# EAGLE design circuit_for_fab (EAGLE 5.11)
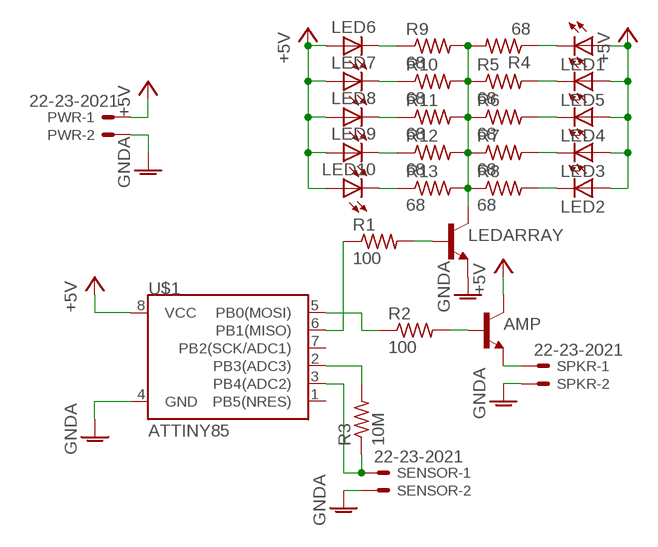
[diagram p0: schematic, sheet 1]

## Parts
AMP  -NPN-TO92-EBC  [TO92-EBC]
LED1  LED5MM  [LED5MM]
LED2  LED5MM  [LED5MM]
LED3  LED5MM  [LED5MM]
LED4  LED5MM  [LED5MM]
LED5  LED5MM  [LED5MM]
LED6  LED5MM  [LED5MM]
LED7  LED5MM  [LED5MM]
LED8  LED5MM  [LED5MM]
LED9  LED5MM  [LED5MM]
LED10  LED5MM  [LED5MM]
LEDARRAY  -NPN-TO92-EBC  [TO92-EBC]
PWR  22-23-2021  [22-23-2021]
R1  100  R-US_0204/7  [0204/7]
R2  100  R-US_0204/7  [0204/7]
R3  10M  R-US_0204/7  [0204/7]
R4  68  R-US_0204/7  [0204/7]
R5  68  R-US_0204/7  [0204/7]
R6  68  R-US_0204/7  [0204/7]
R7  68  R-US_0204/7  [0204/7]
R8  68  R-US_0204/7  [0204/7]
R9  68  R-US_0204/7  [0204/7]
R10  68  R-US_0204/7  [0204/7]
R11  68  R-US_0204/7  [0204/7]
R12  68  R-US_0204/7  [0204/7]
R13  68  R-US_0204/7  [0204/7]
SENSOR  22-23-2021  [22-23-2021]
SPKR  22-23-2021  [22-23-2021]
U$1  ATTINY85  ATTINY45DIP8  [DIP08]

## Nets
+5V: AMP.C LED1.A LED2.A LED3.A LED4.A LED5.A LED6.A LED7.A LED8.A LED9.A LED10.A PWR.1 U$1.8(VCC)
GNDA: LEDARRAY.E PWR.2 SENSOR.2 SPKR.2 U$1.4(GND)
N$1: R3.2 U$1.2(PB3(ADC3))
N$2: LED1.K(C) R4.1
N$3: R1.1 U$1.6(PB1(MISO))
N$4: AMP.B R2.2
N$5: LEDARRAY.C R4.2 R5.1 R6.1 R7.1 R8.1 R9.2 R10.2 R11.2 R12.2 R13.2
N$6: LEDARRAY.B R1.2
N$7: R2.1 U$1.5(PB0(MOSI))
N$8: AMP.E SPKR.1
N$10: LED5.K(C) R5.2
N$11: LED4.K(C) R6.2
N$12: LED3.K(C) R7.2
N$13: LED2.K(C) R8.2
N$14: LED6.K(C) R9.1
N$15: LED7.K(C) R10.1
N$16: LED8.K(C) R11.1
N$17: LED9.K(C) R12.1
N$18: LED10.K(C) R13.1
N$19: R3.1 SENSOR.1 U$1.3(PB4(ADC2))
Unconnected: U$1.1(PB5(NRES)) U$1.7(PB2(SCK/ADC1))

## Library data of the parts
AMP LEDARRAY = transistor:*-NPN-: NPN Transistror BF959 corrected 2008.03.06
LED1-LED10 = led:LED: LED OSRAM: - CHIPLED LG R971, LG N971, LY N971, LG Q971, LY Q971, LO R971, LY R971 LH N974, LH R974 LS Q976, LO Q976, LY Q976 LO Q996 - Hyper CHIPLED LW Q18S LB Q993, LB Q99A, LB R99A - SideLED LS A670, LO A670, LY A670, LG A670, LP A670 LB A673, LV A673, LT A673, LW A673 LH A674 LY A675 LS A676, LA A676, LO A676, LY A676, LW A676 LS A679, LY A679, LG A679 - Hyper Micro SIDELED® LS Y876, LA Y876, LO Y876, LY Y876 LT Y87S - SmartLED LW L88C, LW L88S LB L89C, LB L89S, LG L890 LS L89K, LO L89K, LY L89K LS L896, LA L896, LO L896, LY L896 - TOPLED LS T670, LO T670, LY T670, LG T670, LP T670 LSG T670, LSP T670, LSY T670, LOP T670, LYG T670 LG T671, LOG T671, LSG T671 LB T673, LV T673, LT T673, LW T673 LH T674 LS T676, LA T676, LO T676, LY T676, LB T676, LH T676, LSB T676, LW T676 LB T67C, LV T67C, LT T67C, LS T67K, LO T67K, LY T67K, LW E67C LS E67B, LA E67B, LO E67B, LY E67B, LB E67C, LV E67C, LT E67C LW T67C LS T679, LY T679, LG T679 LS T770, LO T770, LY T770, LG T770, LP T770 LB T773, LV T773, LT T773, LW T773 LH T774 LS E675, LA E675, LY E675, LS T675 LS T776, LA T776, LO T776, LY T776, LB T776 LHGB T686 LT T68C, LB T68C - Hyper Mini TOPLED® LB M676 - Mini TOPLED Santana® LG M470 LS M47K, LO M47K, LY M47K Source: http://www.osram.convergy.de LUXEON: - LUMILED® LXK2-PW12-R00, LXK2-PW12-S00, LXK2-PW14-U00, LXK2-PW14-V00 LXK2-PM12-R00, LXK2-PM12-S00, LXK2-PM14-U00 LXK2-PE12-Q00, LXK2-PE12-R00, LXK2-PE12-S00, LXK2-PE14-T00, LXK2-PE14-U00 LXK2-PB12-K00, LXK2-PB12-L00, LXK2-PB12-M00, LXK2-PB14-N00, LXK2-PB14-P00, LXK2-PB14-Q00 LXK2-PR12-L00, LXK2-PR12-M00, LXK2-PR14-Q00, LXK2-PR14-R00 LXK2-PD12-Q00, LXK2-PD12-R00, LXK2-PD12-S00 LXK2-PH12-R00, LXK2-PH12-S00 LXK2-PL12-P00, LXK2-PL12-Q00, LXK2-PL12-R00 Source: www.luxeon.com KINGBRIGHT: KA-3528ASYC Source: www.kingbright.com
PWR SENSOR SPKR = con-molex:22-23-2021: .100" (2.54mm) Center Header - 2 Pin; MF: MOLEX; MPN: 22-23-2021; OC_FARNELL: 1462926; OC_NEWARK: 25C3832
R1-R13 = rcl:R-US_: RESISTOR, American symbol
U$1 = SparkFun:ATTINY45: Atmel ATTiny45

## Board
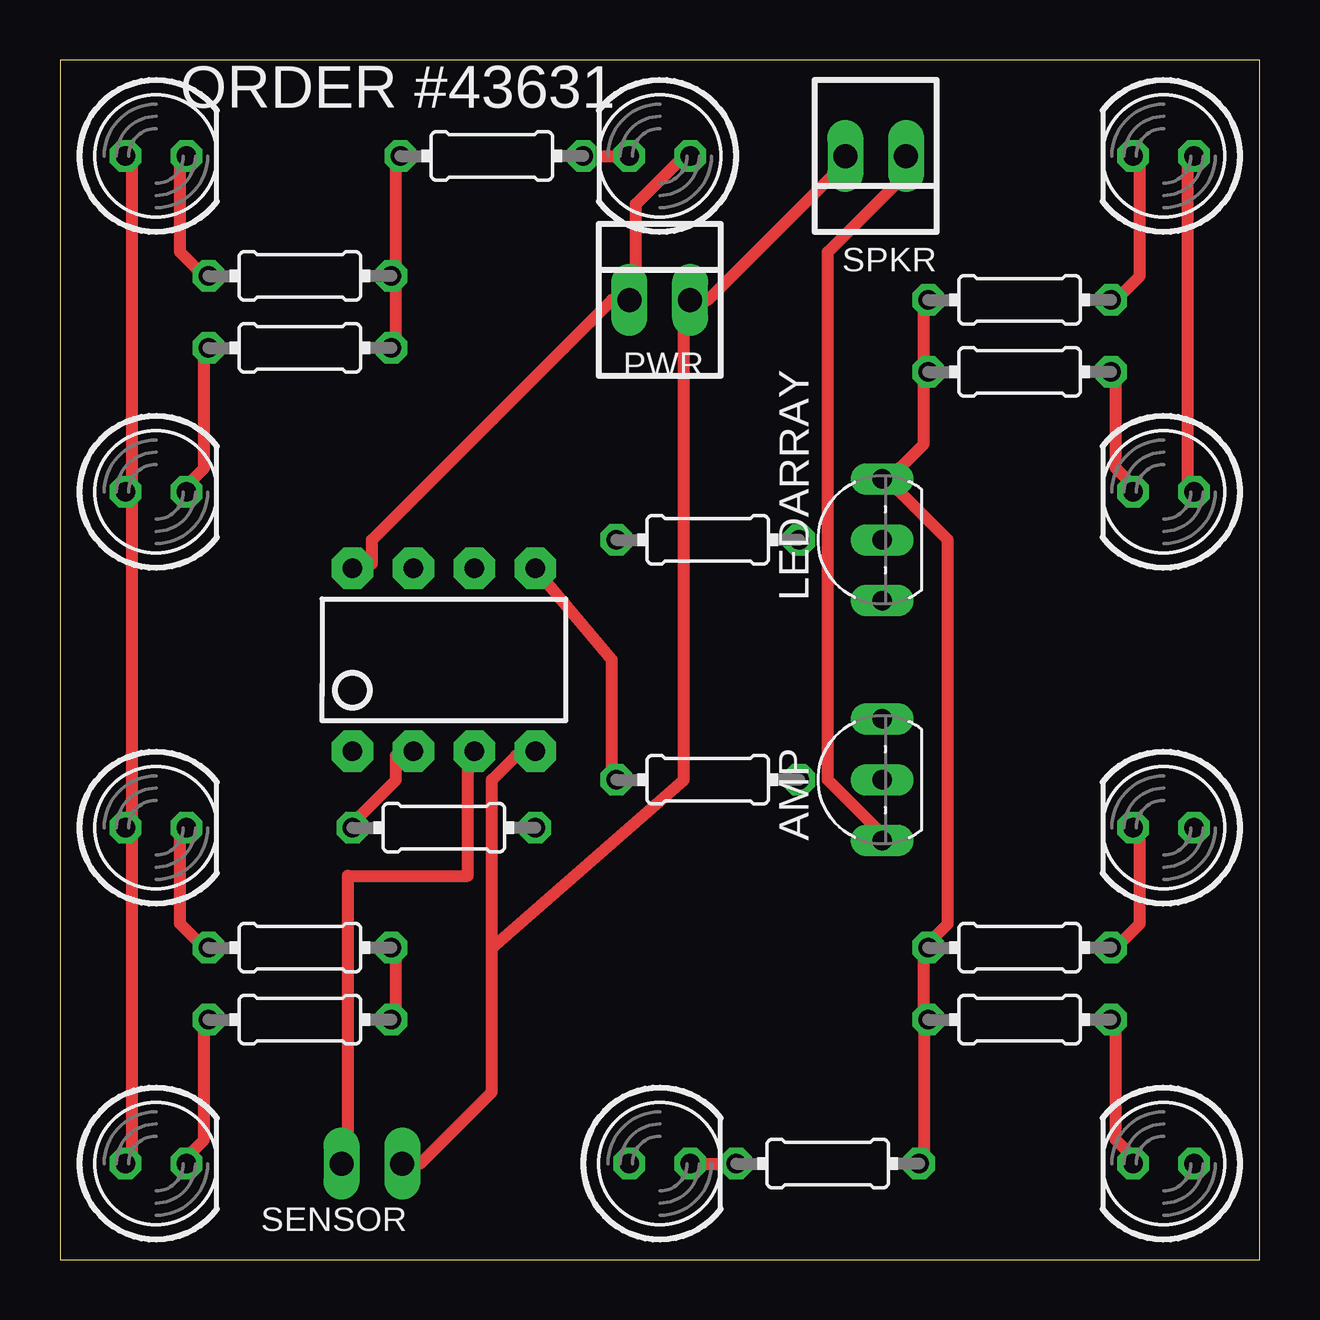
[diagram p1: board, top side]
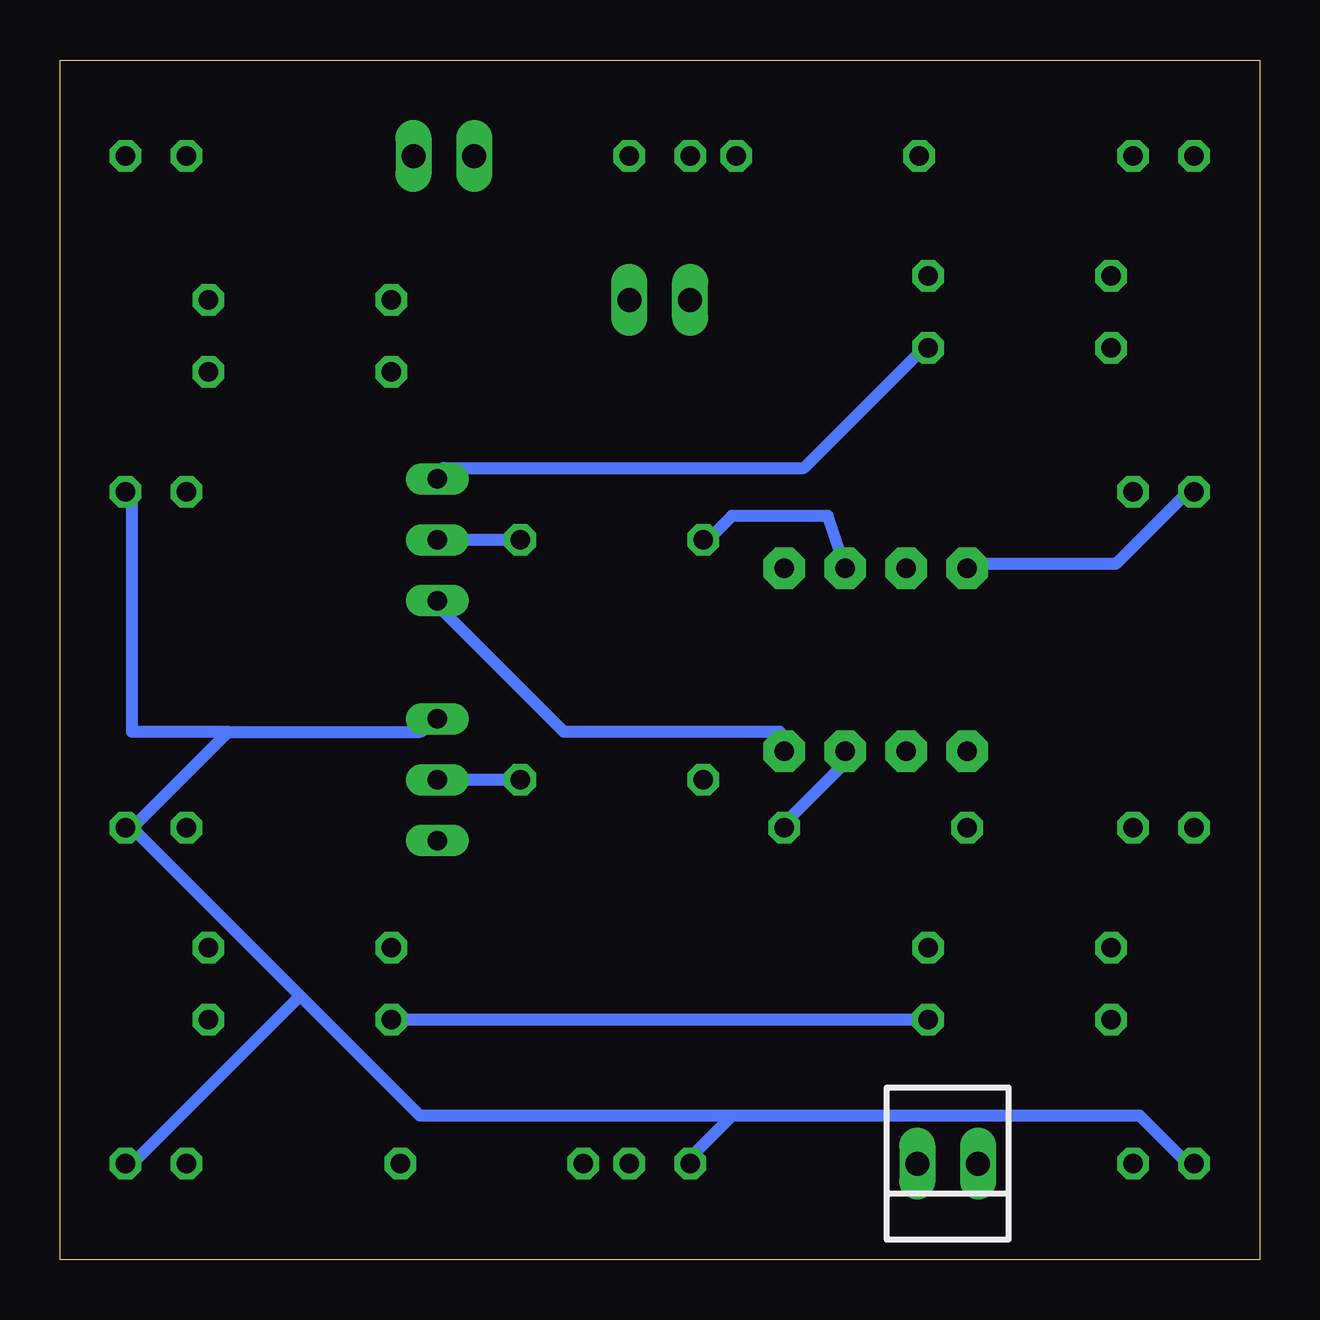
[diagram p2: board, bottom side, seen from below]

Size 50 x 50 mm. Coordinates in mm from the lower left corner, seen from the top.
Outline: 0,0 50,0 50,50 0,50 0,0
Copper layers (1*16): Top 0.035mm / dielectric 1.5mm / Bottom 0.035mm
Design rules "default *": minimum track width 20mil, minimum drill 24mil, track to track 8mil, track to pad 8mil, pad to pad 8mil, via to via 8mil, smd to smd 8mil, copper to edge 40mil, drill to drill 8mil, minimum pad ring 10mil, minimum via ring 8mil, stop-mask expansion 4mil, vias tented up to drill 0mil, thermal gap 10mil

### Footprints (pad centres in the part's own frame; a part is rotated, then mirrored left to right if it is on the bottom)
TO92-EBC = drill 0.813 long: B 0,-1.27; C 2.54,-1.27; E -2.54,-1.27
LED5MM = drill 0.813 octagon: A -1.27,0; K 1.27,0
22-23-2021 = drill 1 long: 1 -1.27,0; 2 1.27,0
0204/7 = drill 0.813 octagon: 1 -3.81,0; 2 3.81,0
DIP08 = drill 0.813 pad 1.727 octagon: 1 -3.81,-3.81; 2 -1.27,-3.81; 3 1.27,-3.81; 4 3.81,-3.81; 5 3.81,3.81; 6 1.27,3.81; 7 -1.27,3.81; 8 -3.81,3.81

### Placement (x,y rotation side)
AMP  33,20 90 top
LED1  4,46 0 top
LED2  4,4 0 top
LED3  46,46 180 top
LED4  46,4 180 top
LED5  25,46 180 top
LED6  25,4 0 top
LED7  4,32 0 top
LED8  4,18 0 top
LED9  46,32 180 top
LED10  46,18 180 top
LEDARRAY  33,30 90 top
PWR  25,40 0 top
R1  27,30 0 top
R2  27,20 0 top
R3  16,18 180 top
R4  10,41 0 top
R5  18,46 0 top
R6  40,10 0 top
R7  40,40 0 top
R8  10,10 180 top
R9  32,4 0 top
R10  10,38 0 top
R11  10,13 0 top
R12  40,37 180 top
R13  40,13 180 top
SENSOR  13,4 180 bottom
SPKR  34,46 180 top
U$1  16,25 0 top

### Tracks (layer width: path | path; a pad name or v marks a point on that pad's centre or on a via)
+5V
  Top 0.508: LED5.A 26,46 24,44 24,40 PWR.1 23,40 13,30 13,29 U$1.8 | 3,32 3,46 LED1.A | LED9.A 47,32 47,46 LED3.A | 3,18 3,4 LED2.A | 3,18 3,32 | 3,32 LED7.A | 3,18 LED8.A
  Bottom 0.508: LED7.A 3,32 6,29 12,29 U$1.8 | 47,18 43,22 | 43,22 35,22 AMP.C | 43,22 47,22 47,32 LED9.A | 22,6 24,4 LED6.A | 22,6 5,6 3,4 LED2.A | 22,6 35,6 40,11 | 40,11 47,18 | 47,18 LED10.A | 40,11 47,4 LED4.A
GNDA
  Top 0.508: SPKR.2 33,46 27,40 PWR.2 26,40 26,20 18,13 | 18,13 18,20 19,21 U$1.4 | 18,13 18,7 15,4 SENSOR.2
  Bottom 0.508: LEDARRAY.E 34,27 29,22 20,22 U$1.4
N$1
  Top 0.508: R3.2 12,18 14,20 14,21 U$1.2
N$2
  Top 0.508: R4.1 6,41 5,42 5,46 LED1.K
N$3
  Bottom 0.508: R1.1 23,30 22,31 18,31 U$1.6
N$4
  Bottom 0.508: R2.2 AMP.B
N$5
  Top 0.508: R8.1 14,10 14,13 R11.2 | 36,10 36,4 R9.2 | 36,10 36,13 | R6.1 36,10 | 14,41 14,38 R10.2 | 14,41 14,46 R5.1 | 14,41 R4.2 | 36,37 36,34 35,33 LEDARRAY.C 35,32 37,30 37,14 36,13 | 36,37 36,40 R7.1 | 36,37 R12.2 | 36,13 R13.2
  Bottom 0.508: R8.1 R6.1 | R10.2 14,38 19,33 34,33 LEDARRAY.C
N$6
  Bottom 0.508: R1.2 LEDARRAY.B
N$7
  Top 0.508: R2.1 23,20 23,25 U$1.5
N$8
  Top 0.508: AMP.E 34,18 32,20 32,42 35,45 35,46 SPKR.1
N$10
  Top 0.508: R5.2 LED5.K 24,46
N$11
  Top 0.508: LED4.K 45,4 44,5 44,10 R6.2
N$12
  Top 0.508: R7.2 44,40 45,41 45,46 LED3.K
N$13
  Top 0.508: LED2.K 5,4 6,5 6,10 R8.2
N$14
  Top 0.508: 26,4 LED6.K R9.1
N$15
  Top 0.508: LED7.K 5,32 6,33 6,38 R10.1
N$16
  Top 0.508: R11.1 6,13 5,14 5,18 LED8.K
N$17
  Top 0.508: LED9.K 45,32 44,33 44,37 R12.1
N$18
  Top 0.508: R13.1 44,13 45,14 45,18 LED10.K
N$19
  Top 0.508: SENSOR.1 12,4 12,16 17,16 17,21 U$1.3
  Bottom 0.508: R3.1 20,18 17,21 U$1.3

### Text on the board
_tsilk: ORDER #43631